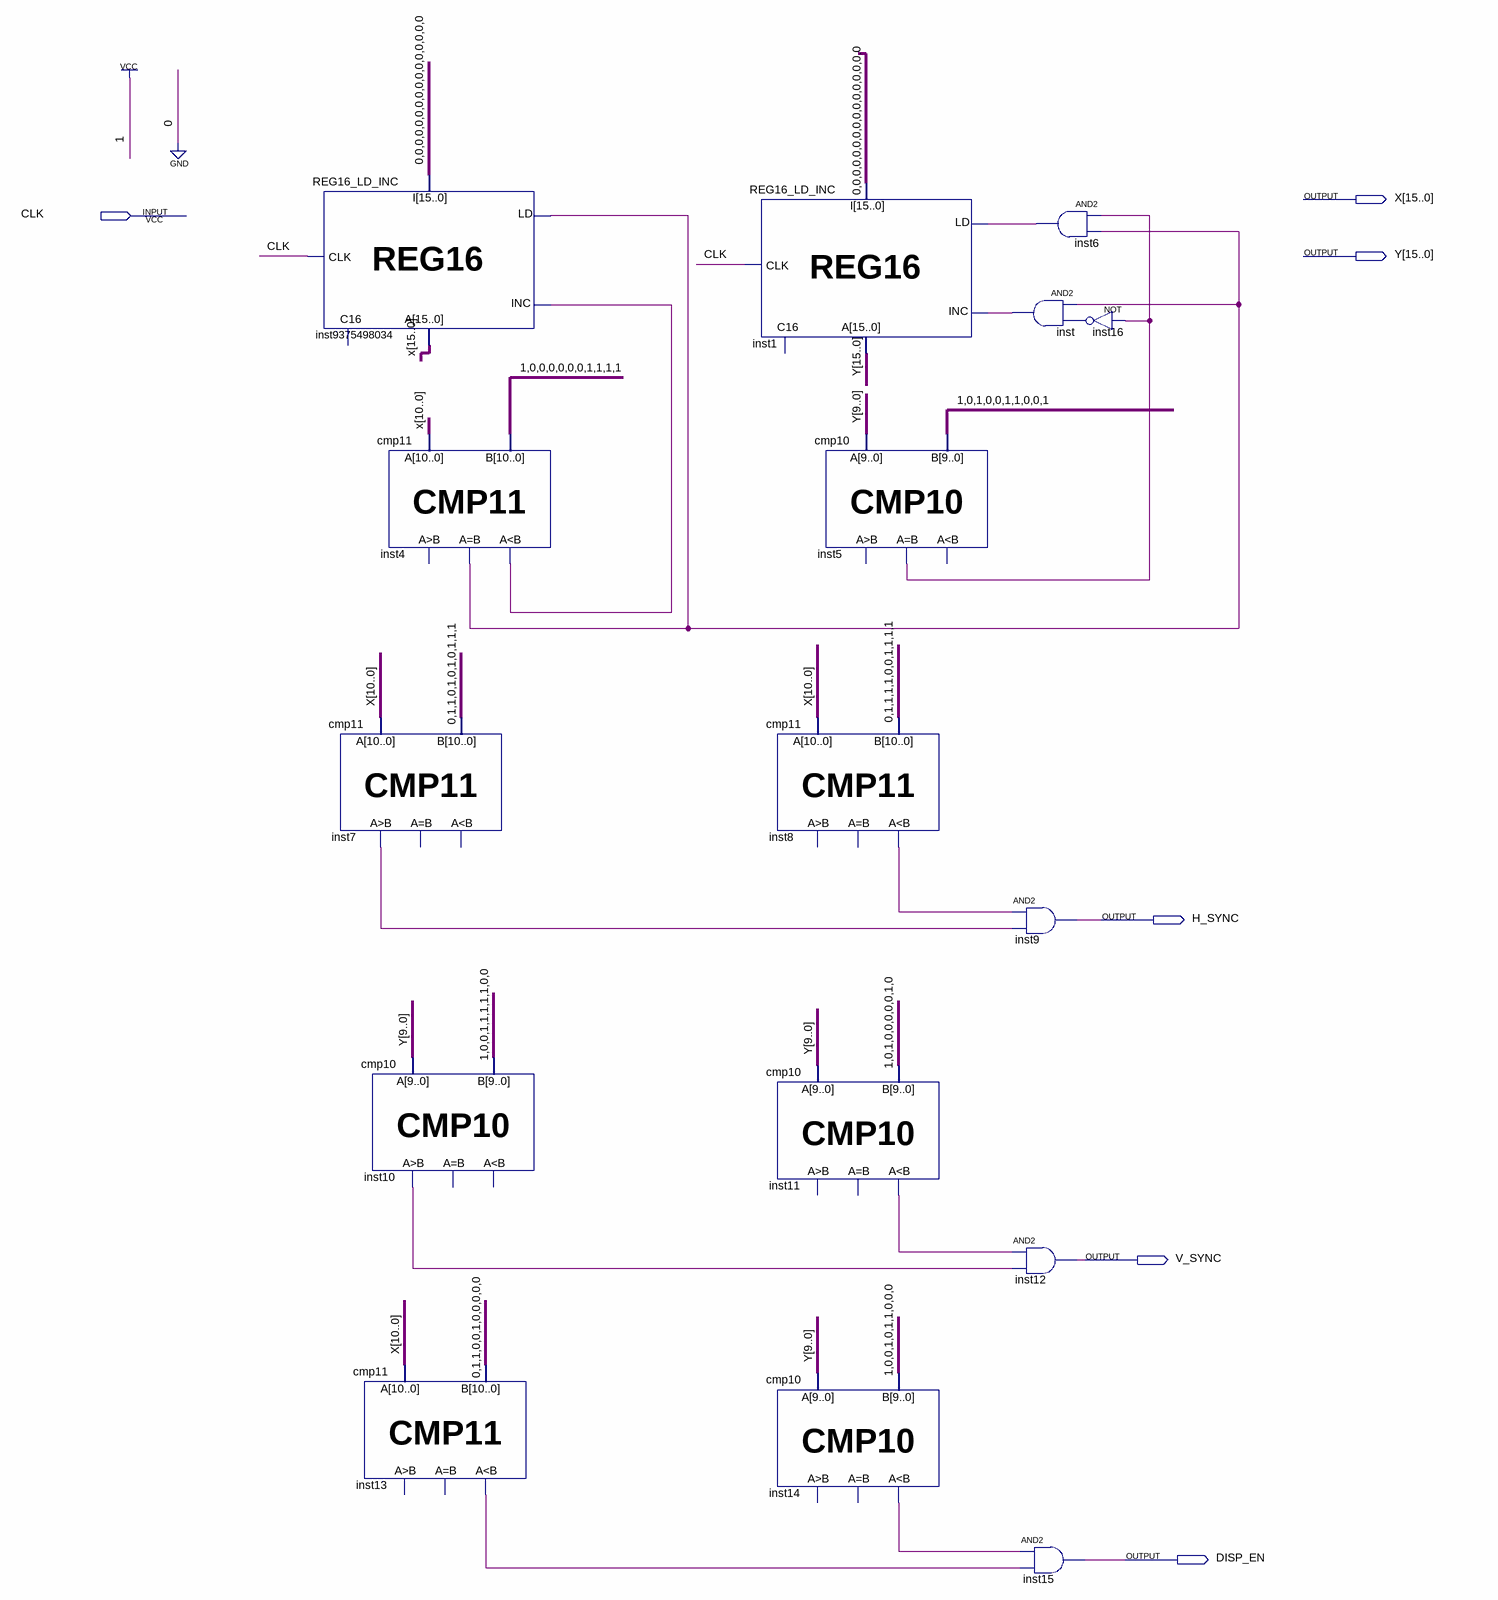
[diagram p0: schematic sheet]
// Quartus schematic VGA_kontroler.bdf as structural Verilog: 16 symbols, 6 pins
module VGA_kontroler (
  input  CLK,
  output [15:0] X,
  output [15:0] Y,
  output H_SYNC,
  output V_SYNC,
  output DISP_EN
);

  wire inst4_eq, inst4_ls, inst5_eq, inst6_out, inst7_gt, inst8_ls, inst10_gt, inst11_ls, inst13_ls,
       inst14_ls, inst16_out, inst_out;

  REG16_LD_INC inst9375498034 (.I({16{1'b0}}), .CLK(CLK), .LD(inst4_eq), .INC(inst4_ls), .A(X));  // open: C16
  cmp11 inst7 (.A(X[10:0]), .B(11'b01101010111), .Gt(inst7_gt));  // open: Ls, Eq
  cmp11 inst4 (.A(X[10:0]), .B(11'b10000001111), .Ls(inst4_ls), .Eq(inst4_eq));  // open: Gt
  cmp10 inst10 (.A(Y[9:0]), .B(10'b1001111100), .Gt(inst10_gt));  // open: Ls, Eq
  cmp11 inst13 (.A(X[10:0]), .B(11'b01100100000), .Ls(inst13_ls));  // open: Eq, Gt
  REG16_LD_INC inst1 (.I({16{1'b0}}), .CLK(CLK), .LD(inst6_out), .INC(inst_out), .A(Y));  // open: C16
  cmp11 inst8 (.A(X[10:0]), .B(11'b01111001111), .Ls(inst8_ls));  // open: Eq, Gt
  cmp10 inst11 (.A(Y[9:0]), .B(10'b1010000010), .Ls(inst11_ls));  // open: Eq, Gt
  cmp10 inst14 (.A(Y[9:0]), .B(10'b1001011000), .Ls(inst14_ls));  // open: Eq, Gt
  cmp10 inst5 (.A(Y[9:0]), .B(10'b1010011001), .Eq(inst5_eq));  // open: Ls, Gt
  and inst6 (inst6_out, inst5_eq, inst4_eq);
  and inst (inst_out, inst4_eq, inst16_out);
  and inst9 (H_SYNC, inst8_ls, inst7_gt);
  and inst12 (V_SYNC, inst11_ls, inst10_gt);
  and inst15 (DISP_EN, inst14_ls, inst13_ls);
  not inst16 (inst16_out, inst5_eq);
endmodule
